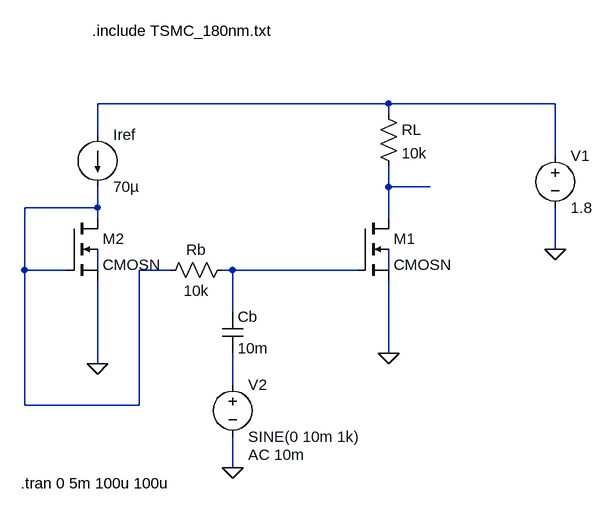
[diagram p0: schematic assign2 ques.asc]
assign2 ques.asc, the LTspice schematic file:
Version 4
SHEET 1 880 744
WIRE 16 144 -432 144
WIRE 272 144 16 144
WIRE 16 160 16 144
WIRE -432 192 -432 144
WIRE 272 224 272 144
WIRE 16 272 16 240
WIRE 80 272 16 272
WIRE -432 304 -432 272
WIRE -432 304 -544 304
WIRE -432 320 -432 304
WIRE 16 320 16 272
WIRE 272 368 272 304
WIRE -544 400 -544 304
WIRE -480 400 -544 400
WIRE -432 400 -432 368
WIRE -320 400 -368 400
WIRE -224 400 -240 400
WIRE -32 400 -224 400
WIRE 16 400 16 368
WIRE -224 464 -224 400
WIRE 16 528 16 416
WIRE -432 544 -432 416
WIRE -224 576 -224 528
WIRE -544 608 -544 400
WIRE -368 608 -368 400
WIRE -368 608 -544 608
WIRE -224 704 -224 656
FLAG 16 528 0
FLAG 272 368 0
FLAG -432 544 0
FLAG -224 704 0
SYMBOL voltage 272 208 R0
WINDOW 123 0 0 Left 0
WINDOW 39 0 0 Left 0
SYMATTR InstName V1
SYMATTR Value 1.8
SYMBOL res 0 144 R0
SYMATTR InstName RL
SYMATTR Value 10k
SYMBOL current -432 192 R0
WINDOW 123 0 0 Left 0
WINDOW 39 0 0 Left 0
SYMATTR InstName Iref
SYMATTR Value 70µ
SYMBOL res -224 384 R90
WINDOW 0 0 56 VBottom 2
WINDOW 3 32 56 VTop 2
SYMATTR InstName Rb
SYMATTR Value 10k
SYMBOL cap -240 464 R0
SYMATTR InstName Cb
SYMATTR Value 10m
SYMBOL voltage -224 560 R0
WINDOW 123 24 124 Left 2
WINDOW 39 0 0 Left 0
SYMATTR Value2 AC 10m
SYMATTR InstName V2
SYMATTR Value SINE(0 10m 1k)
SYMBOL nmos4 -32 320 R0
SYMATTR InstName M1
SYMATTR Value CMOSN
SYMATTR Value2 l=1u w=2u
SYMBOL nmos4 -480 320 R0
SYMATTR InstName M2
SYMATTR Value CMOSN
SYMATTR Value2 l=1u w=2u
TEXT -440 32 Left 2 !.include TSMC_180nm.txt
TEXT -550 728 Left 2 !.tran 0 5m 100u 100u

The netlist it stands for:
* assign2 ques.asc
V1 N001 0 1.8
RL N001 N002 10k
Iref N001 N003 70µ
Rb N005 N003 10k
Cb N005 N007 10m
V2 N007 0 SINE(0 10m 1k) AC 10m
M1 N002 N005 0 N006 CMOSN l=1u w=2u
M2 N003 N003 0 N004 CMOSN l=1u w=2u
.model NMOS NMOS
.model PMOS PMOS
.lib standard.mos
.include TSMC_180nm.txt
.tran 0 5m 100u 100u
.backanno
.end